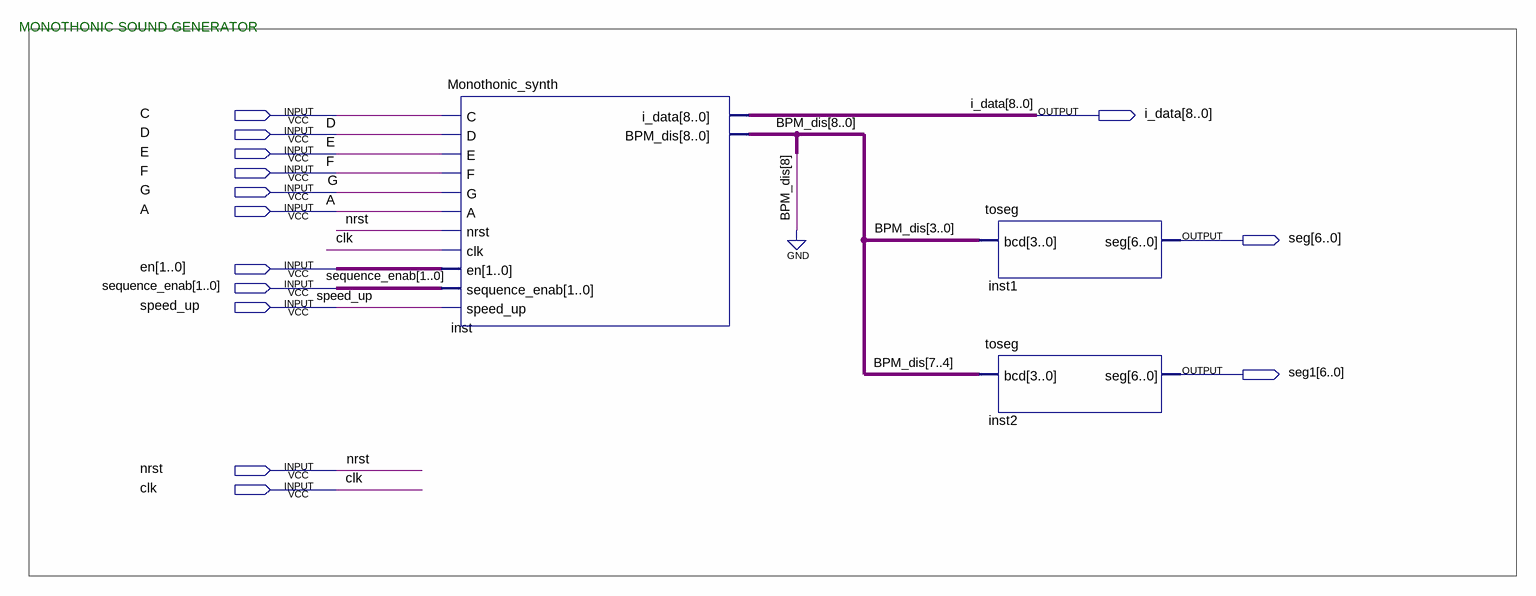
[diagram p0: schematic sheet]
// Quartus schematic Synth.bdf as structural Verilog: 3 symbols, 14 pins
module Synth (
  input  C,
  input  D,
  input  E,
  input  F,
  input  G,
  input  A,
  input  [1:0] en,
  input  [1:0] sequence_enab,
  input  speed_up,
  input  nrst,
  input  clk,
  output [8:0] i_data,
  output [6:0] seg,
  output [6:0] seg1
);

  wire [8:0] BPM_dis;

  Monothonic_synth inst (
    .C(C), .D(D), .E(E), .F(F), .G(G), .A(A), .nrst(nrst), .clk(clk), .en(en), .sequence_enab(sequence_enab),
    .speed_up(speed_up), .i_data(i_data), .BPM_dis(BPM_dis));
  toseg inst1 (.bcd(BPM_dis[3:0]), .seg(seg));
  toseg inst2 (.bcd(BPM_dis[7:4]), .seg(seg1));
  // also tied to GND on the sheet: BPM_dis[8]

  // Notes on the sheet:
  //   MONOTHONIC SOUND GENERATOR
endmodule
